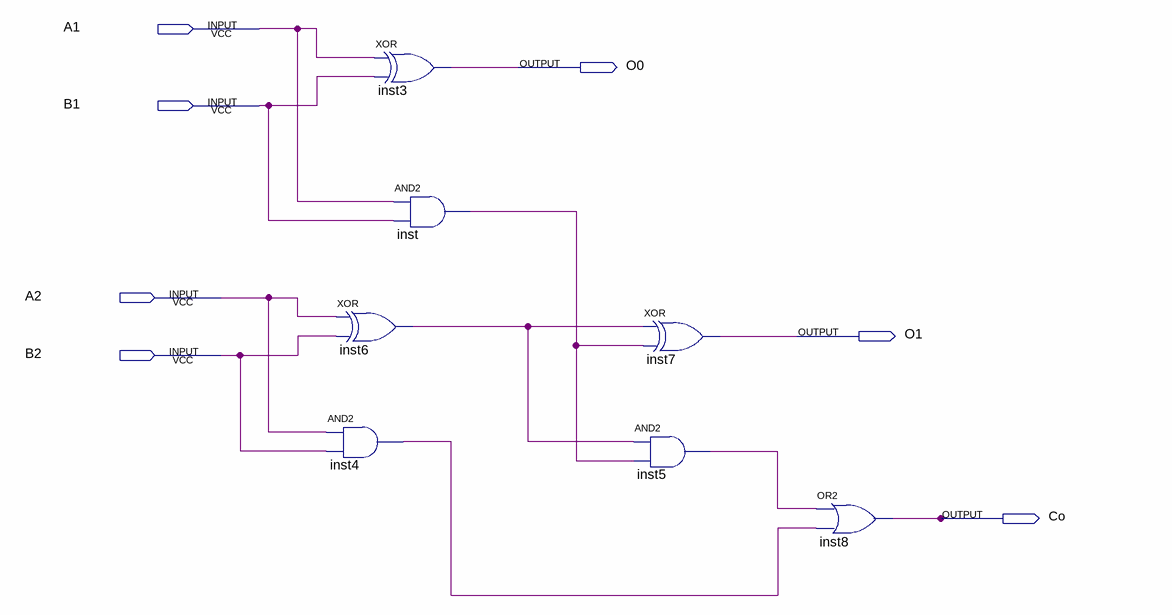
[diagram p0: schematic sheet]
// Quartus schematic FullAdder.bdf as structural Verilog: 7 symbols, 7 pins
module FullAdder (
  input  A1,
  input  B1,
  input  A2,
  input  B2,
  output O0,
  output O1,
  output Co
);

  wire inst4_out, inst5_out, inst6_out, inst_out;

  xor inst6 (inst6_out, A2, B2);
  and inst4 (inst4_out, A2, B2);
  xor inst3 (O0, A1, B1);
  and inst (inst_out, A1, B1);
  xor inst7 (O1, inst6_out, inst_out);
  and inst5 (inst5_out, inst6_out, inst_out);
  or inst8 (Co, inst5_out, inst4_out);
endmodule
